# Altium schematic sheet Power.SchDoc
size A4; SheetNumber: 9; SheetTotal: 10
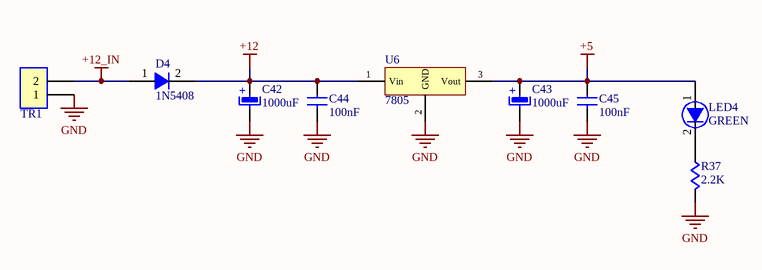
[diagram p0: Power.SchDoc]

## Parts
C42  value 1000uF  [CAP-Elec-10x25-5]  (hidden comment: CAP Elec 1000uF-25V-10x25-THD)
C43  value 1000uF  [CAP-ELEC-SMD-D]  (hidden comment: CAP Elec 1000uF-10V-10x25-THD)
C44  value 100nF  [C-0805]  (hidden comment: CAP Cer 100nF-50V-X7R-SMD)
C45  value 100nF  [C-0805]  (hidden comment: CAP Cer 100nF-50V-X7R-SMD)
D4  Code: 1N5408  [D-DO214]  (hidden comment: Diode 1N5408-SMD)
LED4  Color: GREEN  [LED-1206-Y]  (hidden comment: LED GREEN-1206-SMD)
R37  value 2.2K  [RES-THD-1W-hori-Ls700mil]  (hidden comment: RES 2.2K-5%-1/8W-SMD)
TR1  Terminal KF?/Phoenix-2Pin-?mm-Straight/Right  [KF129-2pin]  (value not drawn)
U6  Code: 7805  [TO220-HEARSINK-1]  (hidden comment: Reg 7805-5V-THD)

## Nets
+5: C43.1 C45.1 LED4.1(A) U6.3(Vout)
+12: C42.1 C44.1 D4.2(C) U6.1(Vin)
+12_IN: D4.1(A) TR1.2
GND: C42.2 C43.2 C44.2 C45.2 R37.2 TR1.1 U6.2(GND)
NetLED4_2: LED4.2(C) R37.1

## Notes on the sheet
- (in symbol CAP-ELEC) +

## Library data of the parts
C42 = CAP-ELEC: CAPACITOR; Phone Number: 0915 8700 314; Voltage: 25V; Type: THD; Publisher: Mahdi Bagherzadeh; ComponentLink1Description: Linkedin; ComponentLink1URL: https://ir.linkedin.com/in/mahdi-bagherzade; Published Date: 9-15-2024; Size: 10x25
C43 = CAP-ELEC: CAPACITOR; Phone Number: 0915 8700 314; Voltage: 10V; Type: THD; Publisher: Mahdi Bagherzadeh; ComponentLink1Description: Linkedin; ComponentLink1URL: https://ir.linkedin.com/in/mahdi-bagherzade; Published Date: 9-15-2024; Size: 10x25
C44 C45 = CAP-CER: CAPACITOR; Phone Number: 0915 8700 314; Voltage: 50V; Tolerance: X7R; Type: SMD; Publisher: Mahdi Bagherzadeh; ComponentLink1Description: Linkedin; ComponentLink1URL: https://ir.linkedin.com/in/mahdi-bagherzade; Published Date: 9-15-2024
D4 = DIODE: Phone Number: 0915 8700 314; Type: SMD; Publisher: Mahdi Bagherzadeh; ComponentLink1Description: Linkedin; ComponentLink1URL: https://ir.linkedin.com/in/mahdi-bagherzade; Published Date: 9-15-2024
LED4 = LED: Phone Number: 0915 8700 314; Type: SMD; Publisher: Mahdi Bagherzadeh; ComponentLink1Description: Linkedin; ComponentLink1URL: https://ir.linkedin.com/in/mahdi-bagherzade; Published Date: 9-15-2024; Size: 1206
R37 = RES: RESISTOR; Phone Number: 0915 8700 314; Tolerance: 5%; Power: 1/8W; Publisher: Mahdi Bagherzadeh; ComponentLink1Description: Linkedin; ComponentLink1URL: https://ir.linkedin.com/in/mahdi-bagherzade; Published Date: 9-15-2024; Type: SMD
TR1 = TEMINAL-2pin: TERMINAL; Phone Number: 0915 8700 314; Publisher: Mahdi Bagherzadeh; ComponentLink1Description: Linkedin; ComponentLink1URL: https://ir.linkedin.com/in/mahdi-bagherzade; Published Date: 9-15-2024; Size: ?mm; Code: KF?/Phoenix-2Pin; Type: Straight/Right
U6 = 78Mxx: REGULATOR; Phone Number: 0915 8700 314; Voltage: 5V; Publisher: Mahdi Bagherzadeh; ComponentLink1Description: Linkedin; ComponentLink1URL: https://ir.linkedin.com/in/mahdi-bagherzade; Published Date: 9-15-2024; Type: THD